# EAGLE schematic schematic (EAGLE 6.6.0)
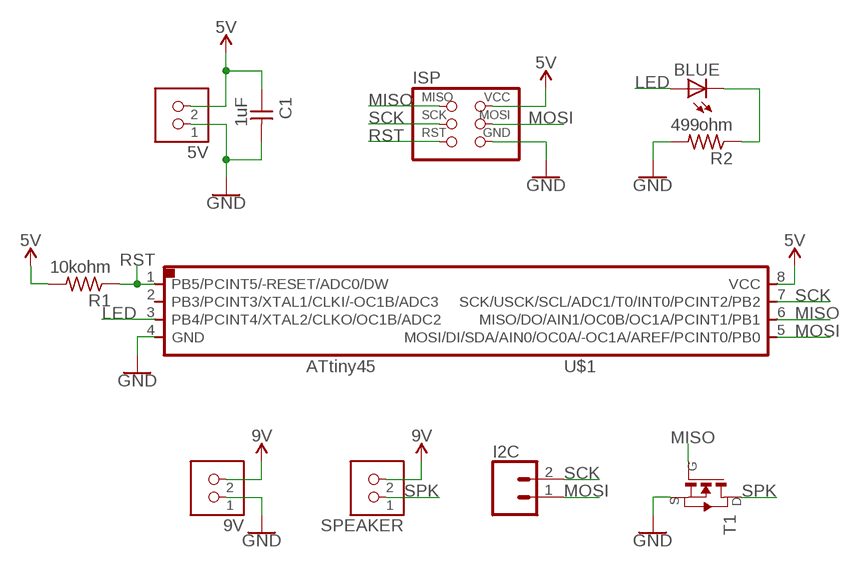
[diagram p0: schematic, sheet 1]

## Parts
5V  TERM-1X02-FABLAB  [ED555DS-2DS]
9V  TERM-1X02-FABLAB  [ED555DS-2DS]
BLUE  LEDFAB1206  [LED1206FAB]
C1  1uF  CAP-UNPOLARIZEDFAB  [C1206FAB]
I2C  CONN_021X02_NO_SILK  [1X02_NO_SILK]
ISP  AVRISPSMD  [2X03SMD]
R1  10kohm  RES-US1206FAB  [R1206FAB]
R2  499ohm  RES-US1206FAB  [R1206FAB]
SPEAKER  TERM-1X02-FABLAB  [ED555DS-2DS]
T1  NMOSFETSOT23  [SOT-23]
U$1  ATTINY45SI  [SOIC8]

## Nets
GND: 5V.1 9V.1 C1.2 ISP.6(GND) R2.2 T1.2(S) U$1.4(GND)
LED: BLUE.1(A) U$1.3(PB4/PCINT4/XTAL2/CLKO/OC1B/ADC2)
MISO: ISP.1(MISO) T1.3(G) U$1.6(MISO/DO/AIN1/OC0B/OC1A/PCINT1/PB1)
MOSI: I2C.1 ISP.4(MOSI) U$1.5(MOSI/DI/SDA/AIN0/OC0A/-OC1A/AREF/PCINT0/PB0)
N$2: BLUE.2(C) R2.1
RST: ISP.5(RST) R1.1 U$1.1(PB5/PCINT5/-RESET/ADC0/DW)
SCK: I2C.2 ISP.3(SCK) U$1.7(SCK/USCK/SCL/ADC1/T0/INT0/PCINT2/PB2)
SPK: SPEAKER.1 T1.1(D)
VCC_1: 5V.2 C1.1 ISP.2(VCC) R1.2 U$1.8(VCC) ; supply symbol labelled 5V
VCC_2: 9V.2 SPEAKER.2 ; supply symbol labelled 9V
Unconnected: U$1.2(PB3/PCINT3/XTAL1/CLKI/-OC1B/ADC3)

## Library data of the parts
5V 9V SPEAKER = fab:TERM-1X02: 3.5mm terminal block, 2 positions ED555-2DS as found in the fablab inventory. Stolen from Adafruit <http://www.ladyada.net/library/pcb/eaglelibrary.html>, adapted by Zaerc.
BLUE = fab:LED: LED
C1 = fab:CAP-UNPOLARIZED
I2C = SparkFun-Connectors:CONN_02: Multi connection point. Often used as Generic Header-pin footprint for 0.1 inch spaced/style header connections On any of the 0.1 inch spaced packages, you can populate with these: Break Away Headers - Straight <https://www.sparkfun.com/products/116> (PRT-00116) Break Away Male Headers - Right Angle <https://www.sparkfun.com/products/553> (PRT-00553) Female Headers <https://www.sparkfun.com/products/115> (PRT-00115) Break Away Headers - Machine Pin <https://www.sparkfun.com/products/117> (PRT-00117) Break Away Female Headers - Swiss Machine Pin <https://www.sparkfun.com/products/743> (PRT-00743) For SCREWTERMINALS and SPRING TERMINALS visit here: Screw Terimnals on SparkFun.com <https://www.sparkfun.com/search/results?term=Screw+Terminals> (5mm/3.5mm/2.54mm spacing) This device is also useful as a general connection point to wire up your design to another part of your project. Our various solder wires solder well into these plated through hole pads. Hook-Up Wire - Assortment (Stranded, 22 AWG) <https://www.sparkfun.com/products/11375> (PRT-11375) Hook-Up Wire - Assortment (Solid Core, 22 AWG) <https://www.sparkfun.com/products/11367> (PRT-11367) View the entire wire category on our website here <https://www.sparkfun.com/categories/141> Special notes: Molex polarized connector foot print use with: PRT-08233 with associated crimp pins and housings. 2.54_SCREWTERM for use with PRT-10571. 3.5mm Screw Terminal footprints for PRT-08084 5mm Screw Terminal footprints for use with PRT-08432
ISP = fab:AVRISP
R1 R2 = fab:RES-US: Resistor (US Symbol) Variants with postfix FAB are widened to allow the routing of internal traces
T1 = fab:NMOSFET: MOS FET
U$1 = fab:ATTINY45